# EasyEDA Pro project ProProject_ESP32-CAN (1)_2024-07-23.epro, schematic can
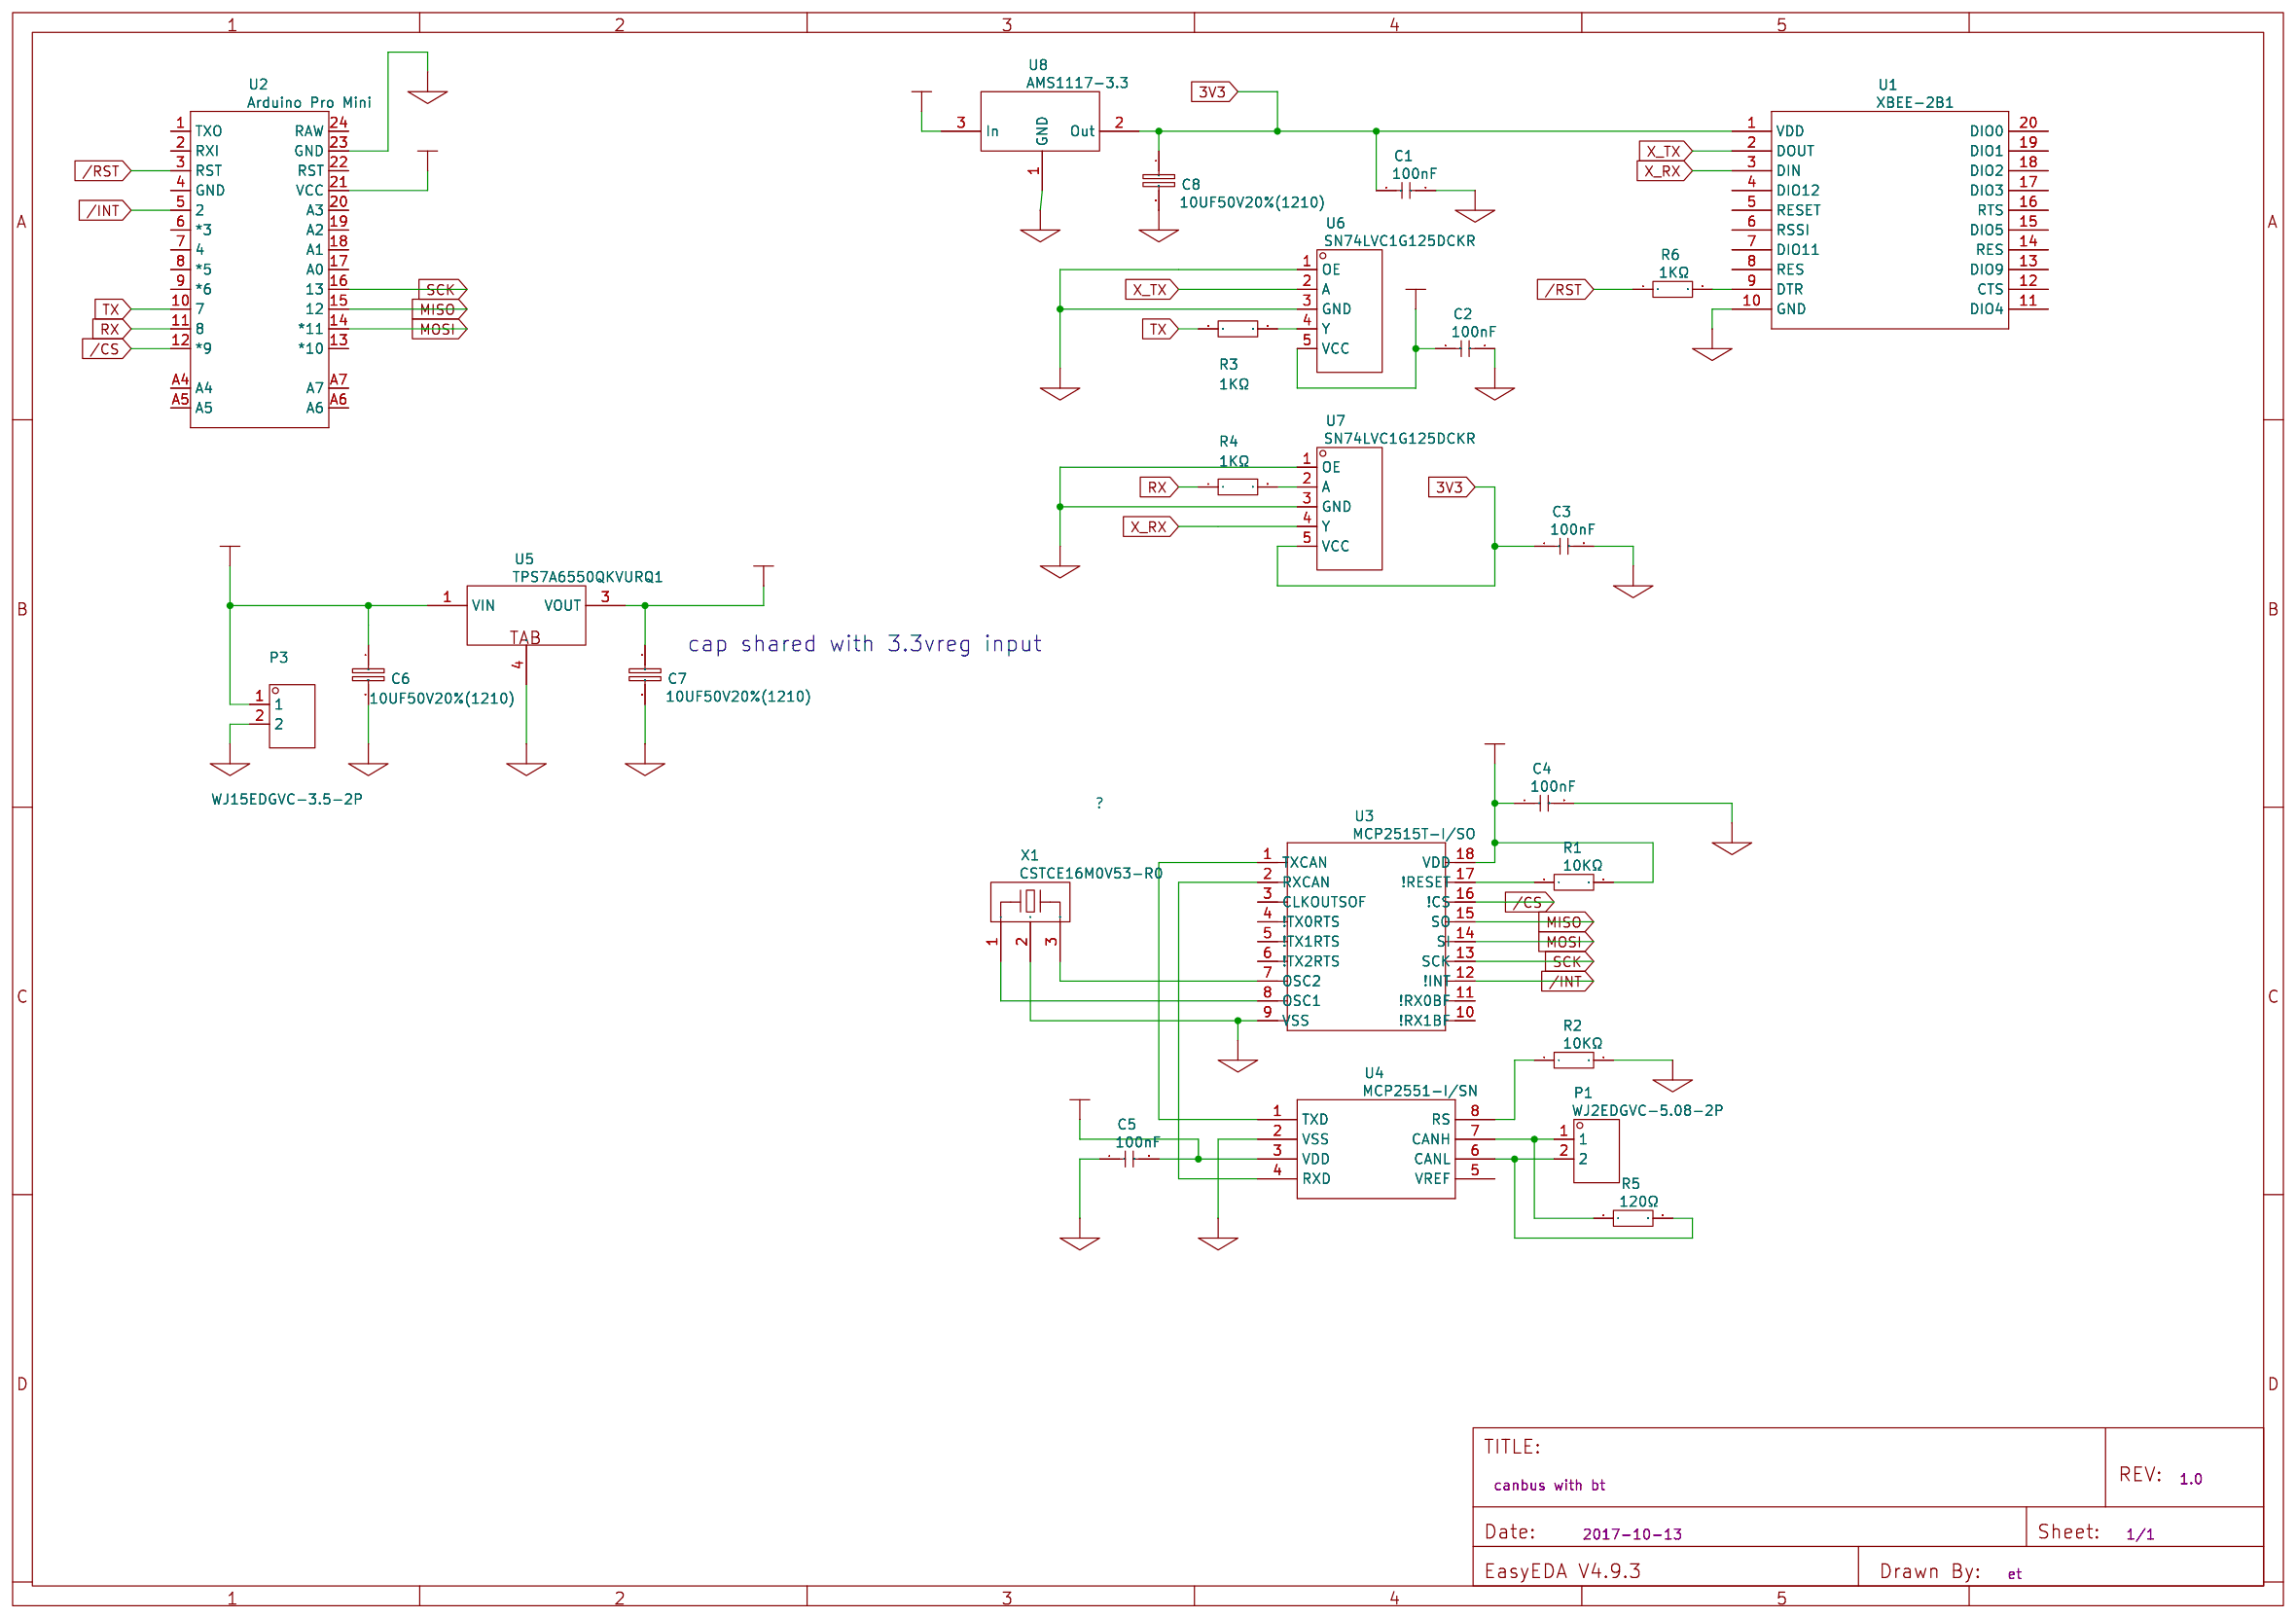
[diagram p0: schematic sheet]

## Parts
C1  100nF
C2  100nF
C3  100nF
C4  100nF
C5  100nF
C6  10UF50V20%(1210)
C7  10UF50V20%(1210)
C8  10UF50V20%(1210)
P1  WJ2EDGVC-5.08-2P
P3  WJ15EDGVC-3.5-2P
R1  10KΩ
R2  10KΩ
R3  1KΩ
R4  1KΩ
R5  120Ω
R6  1KΩ
U1  XBEE-2B1
U2  Arduino Pro Mini
U3  MCP2515T-I/SO
U4  MCP2551-I/SN
U5  TPS7A6550QKVURQ1
U6  SN74LVC1G125DCKR
U7  SN74LVC1G125DCKR
U8  AMS1117-3.3
X1  CSTCE16M0V53-R0

## Library data of the parts
C1-C5 = 100nF: SMD CAP Ceramic 100nF-50V-10%-X7R; Manufacturer Part: CC0603KRX7R9BB104
C6-C8 = 10UF50V20%(1210): Manufacturer Part: ?
P1 = WJ2EDGVC-5.08-2P: Supplier: LCSC; Manufacturer: ReliaPro; Supplier Part: C8445
P3 = WJ15EDGVC-3.5-2P: Supplier: LCSC; Manufacturer: ReliaPro; Manufacturer Part: WJ15EDGVC-3.5MM-2Pneedle; Supplier Part: C42700
R1 R2 = 10KΩ: Power: 1/10W; Tolerance: ±5%; Supplier: LCSC; Manufacturer: UniOhm; Manufacturer Part: 0603WAJ0103T5E; Supplier Part: C15401
R3 R4 R6 = 1KΩ: Power: 1/10W; Tolerance: ±0.1%; Supplier: LCSC; Manufacturer Part: TC0325B1001T5E; Manufacturer: UniOhm; Supplier Part: C54019
R5 = 120Ω: Power: 1/10W; Tolerance: ±1%; Supplier: LCSC; Manufacturer: UniOhm; Manufacturer Part: 0603WAF1200T5E; Supplier Part: C22787
U1 = XBEE-2B1: Xbee module footprints; Manufacturer Part: ?
U2 = Arduino Pro Mini: Manufacturer Part: ?
U3 = MCP2515T-I/SO: SMD IC Interface;
U4 = MCP2551-I/SN: SMD IC Interface
U5 = TPS7A6550QKVURQ1: Single Output Automotive LDO, 300 mA, Fixed 5 V Output, 4 to 40 V Input, 3-pin PFM (KVU), -40 to 125 degC, Green (RoHS  no SbBr); Manufacturer Part: ?
U6 U7 = SN74LVC1G125DCKR: Supplier: LCSC; Manufacturer: TI; Supplier Part: C7833
U8 = AMS1117-3.3: Supplier: LCSC; Manufacturer: AMS; Supplier Part: C6186
X1 = CSTCE16M0V53-R0: Supplier: LCSC; Manufacturer: muRata; Supplier Part: C32180

## Nets
3V3: C1.1 C3.1 C8.1 U1.1(VDD) U7.5(VCC) U8.2(Out)
+5V: C2.1 C4.1 C5.2 C7.1 R1.2 U2.21(VCC) U3.18(VDD) U4.3(VDD) U5.3(VOUT) U6.5(VCC) U8.3(In)
GND: C1.2 C2.2 C3.2 C4.2 C5.1 C6.2 C7.2 C8.2 P3.2 R2.2 U1.10(GND) U2.23(GND) U3.9(VSS) U4.2(VSS) U5.4(TAB) U6.1(OE) U6.3(GND) U7.1(OE) U7.3(GND) U8.1(GND) X1.2
VCC: C6.1 P3.1 U5.1(VIN)
/CS: U2.12(*9) U3.16(!CS)
/INT: U2.5(2) U3.12(!INT)
/RST: R6.1 U2.3(RST)
MISO: U2.15(12) U3.15(SO)
MOSI: U2.14(*11) U3.14(SI)
RX: R4.1 U2.11(8)
SCK: U2.16(13) U3.13(SCK)
TX: R3.1 U2.10(7)
X_RX: U1.3(DIN) U7.4(Y)
X_TX: U1.2(DOUT) U6.2(A)
Net-(P1-1): P1.1 R5.1 U4.7(CANH)
Net-(P1-2): P1.2 R5.2 U4.6(CANL)
Net-(R1-1): R1.1 U3.17(!RESET)
Net-(R2-1): R2.1 U4.8(RS)
Net-(R3-2): R3.2 U6.4(Y)
Net-(R4-2): R4.2 U7.2(A)
Net-(R6-2): R6.2 U1.9(DTR)
Net-(U3-1): U3.1(TXCAN) U4.1(TXD)
Net-(U3-2): U3.2(RXCAN) U4.4(RXD)
Net-(U3-7): U3.7(OSC2) X1.3
Net-(U3-8): U3.8(OSC1) X1.1

Not connected (* = marked no-connect by the designer): U1 4(DIO12) 5(RESET) 6(RSSI) 7(DIO11) 8(RES) 11(DIO4) 12(CTS) 13(DIO9) 14(RES) 15(DIO5) 16(RTS) 17(DIO3) 18(DIO2) 19(DIO1) 20(DIO0); U2 1(TXO) 2(RXI) 4(GND) 6(*3) 7(4) 8(*5) 9(*6) 13(*10) 17(A0) 18(A1) 19(A2) 20(A3) 22(RST) 24(RAW) A4 A5 A6 A7; U3 3(CLKOUTSOF) 4(!TX0RTS) 5(!TX1RTS) 6(!TX2RTS) 10(!RX1BF) 11(!RX0BF); U4 5(VREF)

## Notes on the sheet
- cap shared with 3.3vreg input
